# Altium schematic sheet PSU.SchDoc: PSU TOP
size A4; DocumentNumber: 14; SheetNumber: 14; SheetTotal: 18
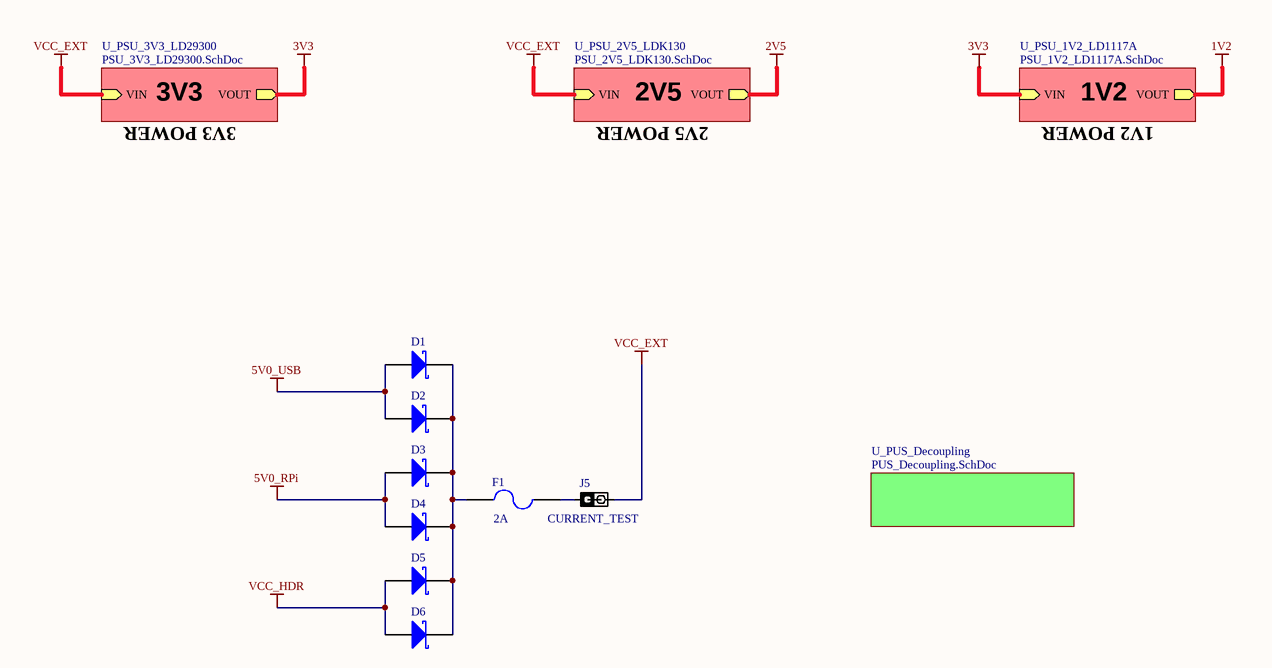
[diagram p0: PSU.SchDoc]

## Parts
D1  D Schottky  [LED-0805-K]  (value not drawn)
D2  D Schottky  [LED-0805-K]  (value not drawn)
D3  D Schottky  [LED-0805-K]  (value not drawn)
D4  D Schottky  [LED-0805-K]  (value not drawn)
D5  D Schottky  [LED-0805-K]  (value not drawn)
D6  D Schottky  [LED-0805-K]  (value not drawn)
F1  Hold Current: 2A  [1812]  (hidden comment: Polyfuse_1812L200THPR)
J5  JMPR2  [JMPR2-CLOSED]  (value not drawn)

## Sub-sheets
U_PSU_1V2_LD1117A = PSU_1V2_LD1117A.SchDoc: VIN (in), VOUT (out)
U_PSU_2V5_LDK130 = PSU_2V5_LDK130.SchDoc: VIN (in), VOUT (out)
U_PSU_3V3_LD29300 = PSU_3V3_LD29300.SchDoc: VIN (in), VOUT (out)
U_PUS_Decoupling = PUS_Decoupling.SchDoc: no entries

## Nets
1V2: sheet U_PSU_1V2_LD1117A/VOUT
2V5: sheet U_PSU_2V5_LDK130/VOUT
3V3: sheet U_PSU_3V3_LD29300/VOUT, sheet U_PSU_1V2_LD1117A/VIN
5V0_RPi: D3.A D4.A
5V0_USB: D1.A D2.A
VCC_EXT: J5.2 ; sheet U_PSU_3V3_LD29300/VIN, sheet U_PSU_2V5_LDK130/VIN
VCC_HDR: D5.A D6.A
NetD1_K: D1.K D2.K D3.K D4.K D5.K D6.K F1.1
NetF1_2: F1.2 J5.1

## Notes on the sheet
- 3V3
- 3V3 POWER
- 2V5
- 2V5 POWER
- 1V2
- 1V2 POWER
- CURRENT_TEST
- Title
- Size:
- Date:
- A4
- Number:
- Time:
- Revision:
- Sheet
- of
- File:

## Library data of the parts
D1-D6 = D Schottky: Schottky Diode - SD0805S020S1R0; Published: 8-Jun-2000; LatestRevisionDate: 17-Jul-2002; LatestRevisionNote: Re-released for DXP Platform.; PackageReference: SMB; Publisher: Altium Limited; PackageDescription: 0805; Code_JEDEC: 0805
F1 = Fuse 2: Polyfuse; Trip Current: 3.5A; Published: 8-Jun-2000; LatestRevisionDate: 17-Jul-2002; LatestRevisionNote: Re-released for DXP Platform.; PackageReference: PIN-W2/E2.8; Publisher: Altium Limited; PackageDescription: SMD-1812
J5 = JMPR2-CLOSED: JMPR2 CLOSED BY DEFAULT; Manufacturer: Sullins Connector Solutions; Manufacturer Part Number: PBC36SAAN; Supplier 1: Digi-Key; Supplier Part Number 1: S1011E-36-ND; Reel: Closed